# Altium schematic sheet motor.SchDoc
size A4
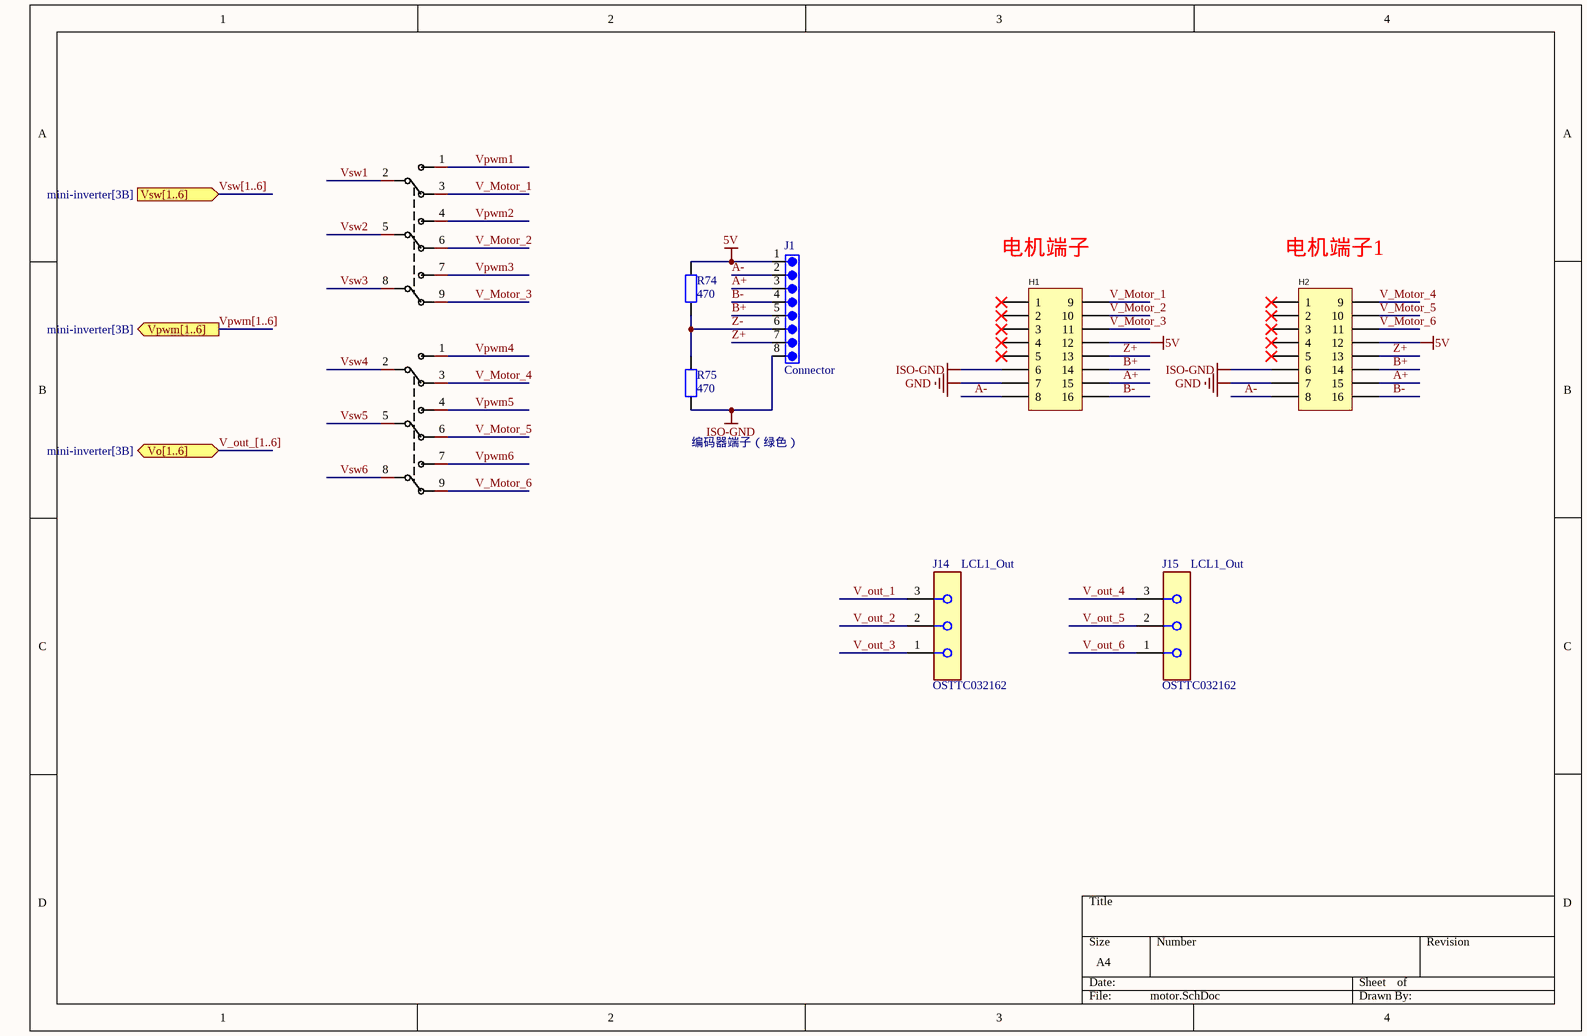
[diagram p0: motor.SchDoc]

## Parts
H1  HC-5557-2*8AW  [CONN-TH_16P-P4.20_5557-2X8AW]  (value not drawn)
H2  HC-5557-2*8AW  [CONN-TH_16P-P4.20_5557-2X8AW]  (value not drawn)
J1  Connector  [691382010008]
J14  LCL1_Out  Part Number: OSTTC032162  [3 Pin Terminal]
J15  LCL1_Out  Part Number: OSTTC032162  [3 Pin Terminal]
R74  470  [RESC1608X05N]
R75  470  [RESC1608X05N]
U18  7307TCWZQE  [SW-TH_9P-L12.7-W16.5-P4.7-LS9.6]  (value not drawn)
U19  7307TCWZQE  [SW-TH_9P-L12.7-W16.5-P4.7-LS9.6]  (value not drawn)

## Ports
Vo[1..6] (bidir, see mini-inverter[3B]), Vpwm[1..6] (out, see mini-inverter[3B]), Vsw[1..6] (in, see mini-inverter[3B])

## Nets
5V: H1.8(12) H2.8(12) J1.1 R74.2
GND: H1.13(7) H2.13(7)
ISO-GND: H1.11(6) H2.11(6) J1.8 R75.1
A+: H1.14(15) H2.14(15) J1.3
A-: H1.15(8) H2.15(8) J1.2
B+: H1.12(14) H2.12(14) J1.5
B-: H1.16 H2.16 J1.4
V_Motor_1: H1.2(9) U18.3
V_Motor_2: H1.4(10) U18.6
V_Motor_3: H1.6(11) U18.9
V_Motor_4: H2.2(9) U19.3
V_Motor_5: H2.4(10) U19.6
V_Motor_6: H2.6(11) U19.9
V_out_1: J14.3
V_out_2: J14.2
V_out_3: J14.1
V_out_4: J15.3
V_out_5: J15.2
V_out_6: J15.1
Vpwm1: U18.1
Vpwm2: U18.4
Vpwm3: U18.7
Vpwm4: U19.1
Vpwm5: U19.4
Vpwm6: U19.7
Vsw1: U18.2
Vsw2: U18.5
Vsw3: U18.8
Vsw4: U19.2
Vsw5: U19.5
Vsw6: U19.8
Z+: H1.10(13) H2.10(13) J1.7
Z-: J1.6 R74.1 R75.2

Not connected (* = marked no-connect by the designer): H1 1* 3(2)* 5(3)* 7(4)* 9(5)*; H2 1* 3(2)* 5(3)* 7(4)* 9(5)*

## Buses and harness runs
bus V_out_[1..6] = port Vo[1..6]
bus Vpwm[1..6] = port Vpwm[1..6]
bus Vsw[1..6] = port Vsw[1..6]

## Notes on the sheet
- (near H1) 电机端子
- (near H2) 电机端子1
- (near R75) 编码器端子（绿色）

## Library data of the parts
H1 H2 = HC-5557-2*8AW: Manufacturer: HCTL(华灿天禄); Add into BOM: yes; Pins Structure: 2x8P; Pitch: 4.2mm; Number of PINs Per Row: 8; Current Rating (Max): 9A; Symbol: HC-5557-2*8AW; Device: HC-5557-2*8AW; LCSC Part Name: 2x8P 间距:4.2mm 弯插; Supplier Part: C2845793; Manufacturer Part: HC-5557-2*8AW; Supplier Footprint: 弯插,P=4.2mm; JLCPCB Part Class: Extended Part; Datasheet: https://atta.szlcsc.com/upload/public/pdf/source/20230620/3AA4118B2C2E81189EA8FE45B17A7E9B.pdf; Supplier: LCSC; Convert to PCB: yes; Mounting Style: 弯插; Reference Series: -; Number of Pins: 16P; Number of Rows: 2; Row Spacing: 4.2mm; Contact Material: 黄铜; Contact Plating: 锡; Operating Temperature Range: -25℃~+85℃
J1 = 691382010008: 8 Position Terminal Block Header, Male Pins, Shrouded (4 Side) 0.098 (2.50mm) 90Â°, Right Angle - Through Hole; Manufacturer: Wurth Elektronik; Availability: In Stock; Package: None; Manufacturer Part Number: 691382010008; Value: *; Purchase-URL: https://pricing.snapeda.com/search/part/691382010008/?ref=eda; SnapEDA_Link: https://www.snapeda.com/parts/691382010008/Wurth+Elektronik/view-part/?ref=snap; Price: None; Check_prices: https://www.snapeda.com/parts/691382010008/Wurth+Elektronik/view-part/?ref=eda
J14 J15 = 3PinTerminal: 3 Position Terminal Block 5.08mm; Manufacturer: On Shore Technology; Voltage: 300V; Is Female: yes; helpURL: https://upverter.com/upn/revision/2b80058b23306b34/; ComponentLink2Description: Datasheet; Temperature: -30°C to +105°C; Package: HDR03; Supplier 2: Mouser; Price: 0.382016875697; Supplier 1: Digi-Key; ComponentLink1URL: https://upverter.com/upn/revision/2b80058b23306b34/; Supplier Part Number 1: ED2610-ND; ComponentLink1Description: Upverter; ComponentLink2URL: https://upverter.com/datasheet/d9a5d2e095ec14efdc364e45047c257fc4ca76eb.pdf; RoHS: TRUE; Temperature Range High: +105°C; Digikey Description: CONN TERM BLOCK 5.08MM VERT 3POS PCB; Digikey Part Number: ED2610-ND; Lead Free: yes; Temperature Range Low: -30°C
R74 R75 = 0603 100KΩ (1003) 1%_4: 贴片电阻; Value: 470Ω(1%); ComponentLink1Description: 供应商链接; ComponentLink1URL: http://www.szlcsc.com/product/details_26546.html; Package: 0603; Supplier: LC; SuppliersPartNumber: C25803
U18 U19 = 7307TCWZQE: Manufacturer: C&K; Add into BOM: yes; Circuit: 三刀双掷; Voltage Rating (AC): 120V; Voltage Rating (DC): 28V; Actuator Type: 圆柱钮柄; Pin Style: 焊片; Symbol: 7307TCWZQE; Device: 7307TCWZQE; LCSC Part Name: 7307TCWZQE 五件套; Supplier Part: C2815234; Manufacturer Part: 7307TCWZQE; Supplier Footprint: 插件; JLCPCB Part Class: Extended Part; Datasheet: https://atta.szlcsc.com/upload/public/pdf/source/20211209/37A386D40B29B4092CECEFBC6A220B9D.pdf; Supplier: LCSC; Convert to PCB: yes; Mounting Style: 直插; Operating Temperature: -30℃~+85℃